# Altium schematic sheet Signal.SchDoc
size A3
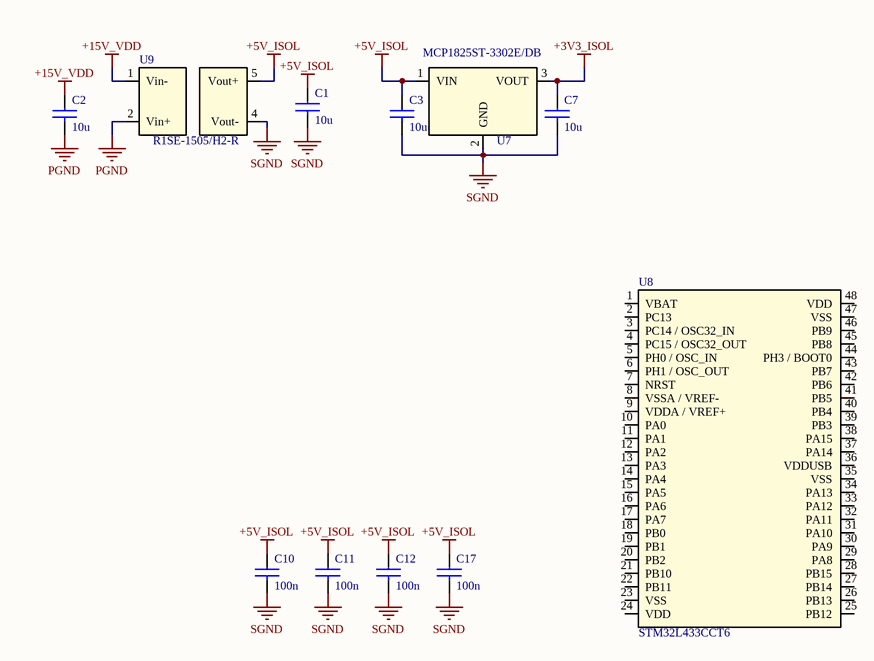
[diagram p0: Signal.SchDoc]

## Parts
C1  10u  [C0805]
C2  10u  [C1206]
C3  10u  [C0805]
C7  10u  [C0805]
C10  100n  [C0805]
C11  100n  [C0805]
C12  100n  [C0805]
C17  100n  [C0805]
U7  MCP1825ST-3302E/DB  [SOT-223-3]
U8  STM32L433CCT6  [LQFP-48]
U9  R1SE-1505/H2-R  [R1SE-1505/H2-R]

## Nets
+3V3_ISOL: C7.1 U7.3(VOUT)
+5V_ISOL: C1.1 C3.1 C10.1 C11.1 C12.1 C17.1 U7.1(VIN) U9.5(Vout+)
+15V_VDD: C2.1 U9.1(Vin-)
PGND: C2.2 U9.2(Vin+)
SGND: C1.2 C3.2 C7.2 C10.2 C11.2 C12.2 C17.2 U7.2(GND) U9.4(Vout-)

Not connected (* = marked no-connect by the designer): U8 1(VBAT) 2(PC13) 3(PC14_/_OSC32_IN) 4(PC15_/_OSC32_OUT) 5(PH0_/_OSC_IN) 6(PH1_/_OSC_OUT) 7(NRST) 8(VSSA_/_VREF-) 9(VDDA_/_VREF+) 10(PA0) 11(PA1) 12(PA2) 13(PA3) 14(PA4) 15(PA5) 16(PA6) 17(PA7) 18(PB0) 19(PB1) 20(PB2) 21(PB10) 22(PB11) 23(VSS) 24(VDD) 25(PB12) 26(PB13) 27(PB14) 28(PB15) 29(PA8) 30(PA9) 31(PA10) 32(PA11) 33(PA12) 34(PA13) 35(VSS) 36(VDDUSB) 37(PA14) 38(PA15) 39(PB3) 40(PB4) 41(PB5) 42(PB6) 43(PB7) 44(PH3_/_BOOT0) 45(PB8) 46(PB9) 47(VSS) 48(VDD); U9 8(NC)

## Library data of the parts
C1 C3 C7 C10-C12 C17 = CAP_0805: 0805 Capacitor
C2 = CAP_1206_10u: CAP CER 10UF 35V X5R 1206; Manufacturer: Murata; Tolerance: ±20%; Supplier 1: Arrow; Category: Capacitors; Voltage - Rated: 35V; Temperature Coefficient: X5R; Mounting Type: Surface Mount, MLCC; Operating Temperature: -55°C ~ 85°C; Package / Case: 1206 (3216 Metric); Size/Dimension: 0.126" L x 0.063" W (3.20mm x 1.60mm); Packaging: Tape & Reel (TR); Supplier 2: Digi-Key; Supplier 1 Part Number: GRM319R6YA106MA12D; Supplier 2 Part Number: 490-9965-2-ND
U7 = MCP1825ST-3302E/DB: IC REG LIN 3.3V 500MA SOT223-3; Manufacturer: Microchip Technology; Manufacturer Part Number: MCP1825S-3302E/DB; Output Configuration: Positive; Output Type: Fixed; Voltage - Input (Max): 6V; Voltage Dropout (Max): 0.35V @ 500mA; PSRR: 60dB (100Hz); Protection Features: Over Temperature, Short Circuit, Under Voltage Lockout (UVLO); Supplier 1: Digi-Key; RoHS: RoHS Compliant; Category: Integrated Circuits (ICs); Stock 1: 7442; Pricing 1: 1=0.54, 25=0.456, 100=0.4134 (USD); Packaging: Tube; Part Status: Active; Voltage - Output (Min/Fixed): 3.3V; Voltage - Output (Max): -; Current - Output: 500mA; Control Features: -; Operating Temperature: -40°C ~ 125°C; Mounting Type: Surface Mount; Package / Case: TO-261-4, TO-261AA; Supplier Device Package: SOT-223-3; Base Part Number: MCP1825S; ComponentLink1URL: http://www.microchip.com/mymicrochip/filehandler.aspx?ddocname=en531698; ComponentLink1Description: http://www.microchip.com/mymicrochip/filehandler.aspx?ddocname=en531698; Supplier Part Number 1: MCP1825S-3302E/DB-ND
U8 = STM32L433CCT6: IC MCU 32BIT 256KB FLASH 48LQFP; Manufacturer: STMicroelectronics; Core Processor: ARM® Cortex®-M4; Core Size: 32-Bit; Speed: 80MHz; Connectivity: CAN, I²C, IrDA, LIN, MMC/SD, QSPI, SAI, SPI, SWPMI, UART/USART, USB; Peripherals: Brown-out Detect/Reset, DMA, LCD, PWM, WDT; Program Memory Size: 256KB (256K x 8); RAM Size: 64K x 8; Voltage - Supply (Vcc/Vdd): 1.71 V ~ 3.6 V; Data Converters: A/D 10x12b, D/A 2x12b; Oscillator Type: Internal; Supplier 1: Digi-Key; Manufacturer Part Number: STM32L433CCT6; RoHS: RoHS Compliant; Category: Integrated Circuits (ICs); Stock 1: 0; Pricing 1: 1=5.85, 10=5.25, 100=4.3017, 500=3.66196, 1000=3.0884 (USD); Packaging: Tray; Part Status: Active; Program Memory Type: FLASH; EEPROM Size: -; Operating Temperature: -40°C ~ 85°C (TA); Package / Case: 48-LQFP; Supplier Device Package: 48-LQFP (7x7); ComponentLink1URL: http://www.st.com/content/ccc/resource/technical/document/datasheet/f7/a0/fc/27/24/4e/4f/3f/DM00257192.pdf/files/DM00257192.pdf/jcr:content/translations/en.DM00257192.pdf; ComponentLink1Description: http://www.st.com/content/ccc/resource/technical/document/datasheet/f7/a0/fc/27/24/4e/4f/3f/DM00257192.pdf/files/DM00257192.pdf/jcr:content/translations/en.DM00257192.pdf; Supplier Part Number 1: 497-16579-ND
U9 = R1SE-1505/H2-R: CONV DC/DC 1W 15VIN 05VOUT; Manufacturer: Recom Power; Voltage - Input (Min): 13.5V; Voltage - Input (Max): 16.5V; Voltage - Output 1: 5V; Current - Output (Max): 200mA; Efficiency: 74%; Supplier 1: Digi-Key; Manufacturer Part Number: R1SE-1505/H2-R; RoHS: RoHS Compliant; Category: Power Supplies - Board Mount; Stock 1: 508; Pricing 1: 1=3.86, 5=3.802, 10=3.749, 25=3.642, 50=3.4278, 100=3.3207, 250=3.2136 (USD); Packaging: Cut Tape (CT); Part Status: Active; Type: Isolated Module; Voltage - Output 2: -; Voltage - Output 3: -; Applications: ITE (Commercial); Features: -; Operating Temperature: -40°C ~ 100°C; Mounting Type: Surface Mount; Package / Case: 8-SMD Module, 5 Leads; Size / Dimension: 0.50" L x 0.42" W x 0.26" H (12.8mm x 10.7mm x 6.7mm); ComponentLink1URL: https://www.recom-power.com/pdf/Econoline/R1SE_H2.pdf; ComponentLink1Description: https://www.recom-power.com/pdf/Econoline/R1SE_H2.pdf; Supplier Part Number 1: 945-2276-1-ND